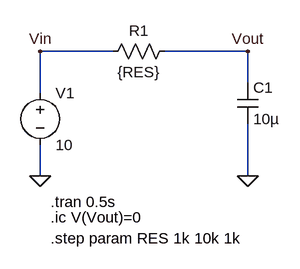
[diagram p0: schematic Linear_Resistor_Param_RC.asc]
Linear_Resistor_Param_RC.asc, the LTspice schematic file:
Version 4
SHEET 1 880 680
WIRE 192 80 80 80
WIRE 400 80 272 80
WIRE 400 128 400 80
WIRE 80 144 80 80
WIRE 80 272 80 224
WIRE 400 272 400 192
FLAG 80 272 0
FLAG 400 272 0
FLAG 80 80 Vin
FLAG 400 80 Vout
SYMBOL voltage 80 128 R0
WINDOW 123 0 0 Left 0
WINDOW 39 0 0 Left 0
SYMATTR InstName V1
SYMATTR Value 10
SYMBOL res 288 64 R90
WINDOW 0 0 56 VBottom 2
WINDOW 3 32 56 VTop 2
SYMATTR InstName R1
SYMATTR Value {RES}
SYMBOL cap 384 128 R0
SYMATTR InstName C1
SYMATTR Value 10µ
TEXT 96 312 Left 2 !.tran 0.5s
TEXT 96 336 Left 2 !.ic V(Vout)=0
TEXT 96 368 Left 2 !.step param RES 1k 10k 1k

The netlist it stands for:
* Linear_Resistor_Param_RC.asc
V1 Vin 0 10
R1 Vout Vin {RES}
C1 Vout 0 10µ
.tran 0.5s
.ic V(Vout)=0
.step param RES 1k 10k 1k
.backanno
.end

* Results of the author's LTspice run, read from the files saved beside the schematic
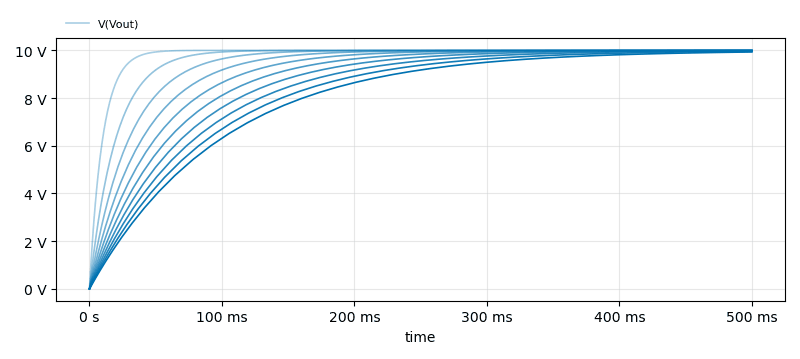
[diagram p1: Transient Analysis of Linear_Resistor_Param_RC.asc, plotted from the saved traces]
* Transient Analysis, 10 runs:
*   V(Vout) [res=1000]: min 0 V, max 10 V, average 9.8 V, rms 9.849 V, last 10 V
*   V(Vout) [res=2000]: min 0 V, max 10 V, average 9.6 V, rms 9.695 V, last 10 V
*   V(Vout) [res=3000]: min 0 V, max 10 V, average 9.399 V, rms 9.539 V, last 10 V
*   V(Vout) [res=4000]: min 0 V, max 10 V, average 9.199 V, rms 9.381 V, last 10 V
*   V(Vout) [res=5000]: min 0 V, max 10 V, average 8.999 V, rms 9.219 V, last 10 V
*   V(Vout) [res=6000]: min 0 V, max 9.998 V, average 8.799 V, rms 9.055 V, last 9.998 V
*   V(Vout) [res=7000]: min 0 V, max 9.992 V, average 8.6 V, rms 8.889 V, last 9.992 V
*   V(Vout) [res=8000]: min 0 V, max 9.981 V, average 8.401 V, rms 8.721 V, last 9.981 V